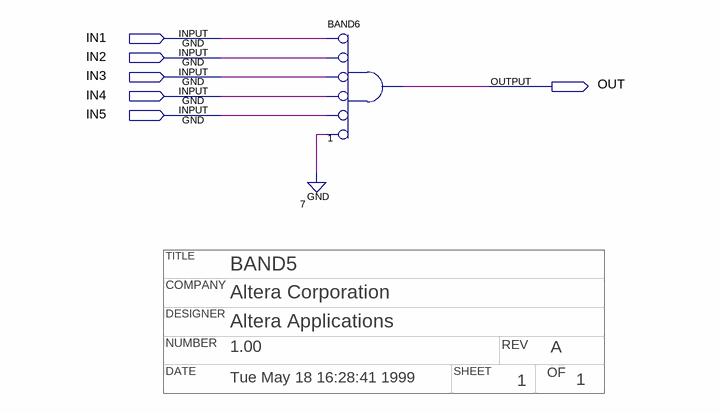
[diagram p0: schematic sheet]
// Quartus schematic band5.bdf as structural Verilog: 1 symbols, 6 pins
// Title block: TITLE: BAND5; COMPANY: Altera Corporation; DESIGNER: Altera Applications; NUMBER: 1.00; REV: A; DATE: Tue May 18 16:28:41 1999; SHEET: 1; OF: 1
module band5 (
  input  IN1,
  input  IN2,
  input  IN3,
  input  IN4,
  input  IN5,
  output OUT
);

  and u_1 (OUT, ~IN1, ~IN2, ~IN3, ~IN4, ~IN5, ~1'b0);  // BAND6
endmodule
